# EAGLE design MicrocontrollerCircuit (EAGLE 8.4.1)
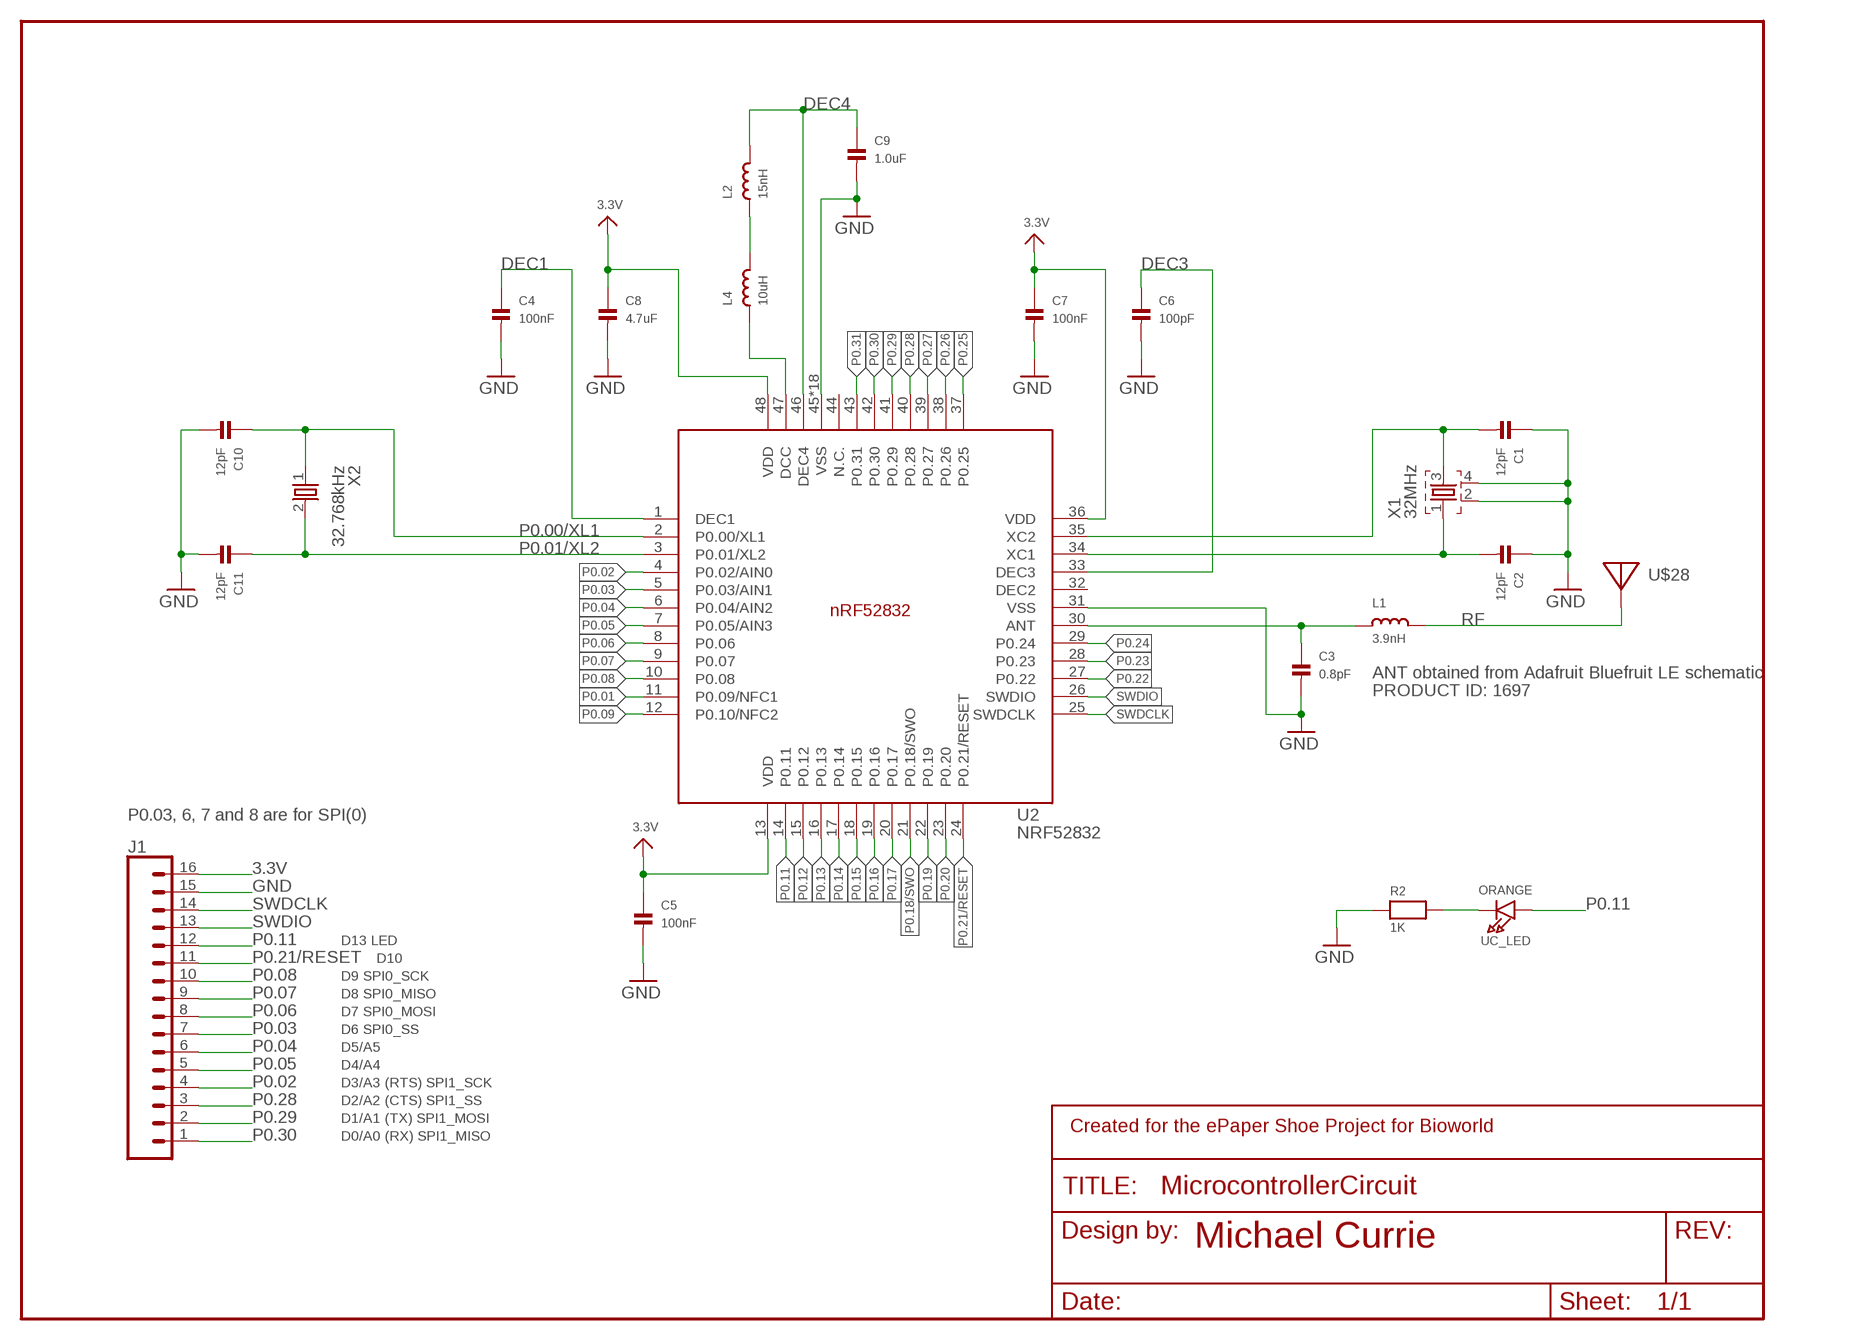
[diagram p0: schematic, sheet 1]

## Parts
C1  12pF  CAP_CERAMIC1206  [1206]
C2  12pF  CAP_CERAMIC1206  [1206]
C3  0.8pF  CAP_CERAMIC1206  [1206]
C4  100nF  CAP_CERAMIC1206  [1206]
C5  100nF  CAP_CERAMIC1206  [1206]
C6  100pF  CAP_CERAMIC1206  [1206]
C7  100nF  CAP_CERAMIC1206  [1206]
C8  4.7uF  CAP_CERAMIC1206  [1206]
C9  1.0uF  CAP_CERAMIC1206  [1206]
C10  12pF  CAP_CERAMIC1206  [1206]
C11  12pF  CAP_CERAMIC1206  [1206]
FRAME2  FRAME-LETTER-MICHAELNO_PACKAGE  [DUMMY]
J1  CONN_16  [1X16]
L1  3.9nH  INDUCTOR0805  [0805]
L2  15nH  INDUCTOR0805  [0805]
L4  10uH  INDUCTOR0805  [0805]
R2  1K  RESISTOR0805  [0805]
U2  NRF52832  [QFN40P600X600X90-48_N]
U$28  ANTENNA_PCBNRF8001_1.6MM  [ANT_PCB_2.4GHZ_NRF8001_1.6MM_1OZ]
UC_LED  ORANGE  LED0805_NOOUTLINE  [CHIPLED_0805_NOOUTLINE]
X1  32MHz  XTAL_32MHZ  [BT-XTAL_2016_N]
X2  32.768kHz  XTAL_32KHZ  [XTAL_3215_N]

## Nets
3.3V: C5.1 C7.1 C8.1 J1.16 U2.13(VDD) U2.36(VDD) U2.48(VDD)
ANT: C3.1 L1.1 U2.30(ANT)
DEC1: C4.1 U2.1(DEC1)
DEC3: C6.1 U2.33(DEC3)
DEC4: C9.1 L2.2 U2.46(DEC4)
GND: C1.1 C2.1 C3.2 C4.2 C5.2 C6.2 C7.2 C8.2 C9.2 C10.2 C11.2 J1.15 R2.1 U2.31(VSS) U2.45(VSS) U2.PAD(VSS) U2.PAD@VIA01(VSS) U2.PAD@VIA02(VSS) U2.PAD@VIA03(VSS) U2.PAD@VIA04(VSS) U2.PAD@VIA05(VSS) U2.PAD@VIA06(VSS) U2.PAD@VIA07(VSS) U2.PAD@VIA08(VSS) U2.PAD@VIA09(VSS) U2.PAD@VIA10(VSS) U2.PAD@VIA11(VSS) U2.PAD@VIA12(VSS) U2.PAD@VIA13(VSS) U2.PAD@VIA14(VSS) U2.PAD@VIA15(VSS) U2.PAD@VIA16(VSS) X1.2 X1.4
N$1: L2.1 L4.2
N$3: C1.2 U2.35(XC2) X1.3
N$5: L4.1 U2.47(DCC)
N$15: R2.2 UC_LED.C
P0.00/XL1: C10.1 U2.2(P0.00/XL1) X2.1
P0.01: U2.11(P0.09/NFC1)
P0.01/XL2: C11.1 U2.3(P0.01/XL2) X2.2
P0.02: J1.4 U2.4(P0.02/AIN0)
P0.03: J1.7 U2.5(P0.03/AIN1)
P0.04: J1.6 U2.6(P0.04/AIN2)
P0.05: J1.5 U2.7(P0.05/AIN3)
P0.06: J1.8 U2.8(P0.06)
P0.07: J1.9 U2.9(P0.07)
P0.08: J1.10 U2.10(P0.08)
P0.09: U2.12(P0.10/NFC2)
P0.11: J1.12 U2.14(P0.11) UC_LED.A
P0.12: U2.15(P0.12)
P0.13: U2.16(P0.13)
P0.14: U2.17(P0.14)
P0.15: U2.18(P0.15)
P0.16: U2.19(P0.16)
P0.17: U2.20(P0.17)
P0.18/SWO: U2.21(P0.18/SWO)
P0.19: U2.22(P0.19)
P0.20: U2.23(P0.20)
P0.21/RESET: J1.11 U2.24(P0.21/RESET)
P0.22: U2.27(P0.22)
P0.23: U2.28(P0.23)
P0.24: U2.29(P0.24)
P0.25: U2.37(P0.25)
P0.26: U2.38(P0.26)
P0.27: U2.39(P0.27)
P0.28: J1.3 U2.40(P0.28)
P0.29: J1.2 U2.41(P0.29)
P0.30: J1.1 U2.42(P0.30)
P0.31: U2.43(P0.31)
RF: L1.2 U$28.FEED
SWDCLK: J1.14 U2.25(SWDCLK)
SWDIO: J1.13 U2.26(SWDIO)
X1: C2.2 U2.34(XC1) X1.1
Unconnected: U2.32(DEC2) U2.44(N.C.)

## Notes on the sheet
- ANT obtained from Adafruit Bluefruit LE schematic
- PRODUCT ID: 1697
- P0.03, 6, 7 and 8 are for SPI(0)
- D13 LED
- D10
- D9 SPI0_SCK
- D8 SPI0_MISO
- D7 SPI0_MOSI
- D6 SPI0_SS
- D5/A5
- D4/A4
- D3/A3 (RTS) SPI1_SCK
- D2/A2 (CTS) SPI1_SS
- D1/A1 (TX) SPI1_MOSI
- D0/A0 (RX) SPI1_MISO

## Library data of the parts
C1-C11 = microbuilder:CAP_CERAMIC: Ceramic Capacitors 0402 - 0402 Surface Mount Capacitors 16pF 50V 5% [Digikey: 445-4899-2-ND] 18pF 50V 5% [Digikey: 490-1281-2-ND] 22pF 50V 5% [Digikey: 490-1283-2-ND] 68pF 50V 5% [Digikey: 490-1289-2-ND] 0.1uF 10V 10% [Digikey: 490-1318-2-ND] 1.0uF 6.3V 10% [Digikey: 490-1320-2-ND] 0603 - 0603 Surface Mount Capacitors 16 pF 50V 5% [Digikey: 445-5051-2-ND] 22 pF 50V [Digikey: PCC220ACVTR-ND] 33 pF 50V 5% [Digikey: 490-1415-1-ND] 56pF 50V 5% [Digikey: 490-1421-1-ND] 220pF 50V 5% [Digikey: 445-1285-1-ND] 680 pF 50V 2200 pF 50V 5% C0G [Digikey: 445-1297-1-ND] 5600 pF 100V 5% X7R [Digikey: 478-3711-1-ND] 0.1 µF 25V 10% [Digikey: PCC2277TR-ND] 0.22 µF 16V 10% X7R [Digikey: 445-1318-1-ND] 1.0 µF 25V 10% [Digikey: 445-5146-2-ND] 0603 - RF Specific 3pF 250V +/-0.1pF RF [Digikey: 712-1347-1-ND] 18 pF 250V 5% [Digikey: 478-3505-1-ND or 712-1322-1-ND] 56 pF 250V 5% C0G RF [Digikey: 490-4867-1-ND] 68 pF 250V RF [Digikey: 490-4868-1-ND] 0805 - 0805 Surface Mount Capacitors 220 pF 250V 2% RF Ceramic Capacitor [Digikey: 712-1398-1-ND] 1000 pF 50V 2% NP0 Ceramic Capacitor [Digikey: 478-3760-1-ND] 0.1 µF 25V 10% Ceramic Capacitor [Digikey: PCC1828TR-ND] 1.0 µF 16V 10% Ceramic Capacitor[Digikey: 490-1691-2-ND] 10.0 µF 10V 10% Ceramic Capacitor[Digikey: 709-1228-1-ND] 10.0 uF 16V 10% Ceramic Capacitor [Digikey: 478-5165-2-ND] 47 uF 6.3V 20% Ceramic Capacitor [Digikey: 587-1779-1-ND or 399-5506-1-ND] 1206 - 1206 Surface Mount Capacitors 47uF 10V 20% Ceramic Capacitor [Digikey: 490-5528-1-ND or 399-5508-1-ND or 445-6010-1-ND] 100uF 6.3V -20%, +80% Y5V Ceramic Capacitor (Digikey: 490-4512-1-ND, Mouser: 81-GRM31CF50J107ZE1L)
FRAME2 = SparkFun-Aesthetics:FRAME-LETTER-MICHAEL: Schematic Frame - Letter Standard 8.5x11 US Letter frame; DESIGNER: Nobody; VERSION: v01
J1 = SparkFun-Connectors:CONN_16: Multi connection point. Often used as Generic Header-pin footprint for 0.1 inch spaced/style header connections On any of the 0.1 inch spaced packages, you can populate with these: Break Away Headers - Straight <https://www.sparkfun.com/products/116> (PRT-00116) Break Away Male Headers - Right Angle <https://www.sparkfun.com/products/553> (PRT-00553) Female Headers <https://www.sparkfun.com/products/115> (PRT-00115) Break Away Headers - Machine Pin <https://www.sparkfun.com/products/117> (PRT-00117) Break Away Female Headers - Swiss Machine Pin <https://www.sparkfun.com/products/743> (PRT-00743) For SCREWTERMINALS and SPRING TERMINALS visit here: Screw Terimnals on SparkFun.com <https://www.sparkfun.com/search/results?term=Screw+Terminals> (5mm/3.5mm/2.54mm spacing) This device is also useful as a general connection point to wire up your design to another part of your project. Our various solder wires solder well into these plated through hole pads. Hook-Up Wire - Assortment (Stranded, 22 AWG) <https://www.sparkfun.com/products/11375> (PRT-11375) Hook-Up Wire - Assortment (Solid Core, 22 AWG) <https://www.sparkfun.com/products/11367> (PRT-11367) View the entire wire category on our website here <https://www.sparkfun.com/categories/141> Special notes: Molex polarized connector foot print use with SKU : PRT-08231 with associated crimp pins and housings. 1MM SMD Version SKU: PRT-10208 NOTES ON THE VARIANTS LOCK and LOCK_LONGPADS... This footprint was designed to help hold the alignment of a through-hole component (i.e. 6-pin header) while soldering it into place. You may notice that each hole has been shifted either up or down by 0.005 of an inch from it's more standard position (which is a perfectly straight line). This slight alteration caused the pins (the squares in the middle) to touch the edges of the holes. Because they are alternating, it causes a "brace" to hold the component in place. 0.005 has proven to be the perfect amount of "off-center" position when using our standard breakaway headers. Although looks a little odd when you look at the bare footprint, once you have a header in there, the alteration is very hard to notice. Also,if you push a header all the way into place, it is covered up entirely on the bottom side.
L1 L2 L4 = microbuilder:INDUCTOR: Inductors 0603: 10nH Ceramic Inductor - microwire antenna/RF (Digikey: 712-1434-2-ND) 0805: 560nH Ceramic Inductor - RF (Digikey: 553-1047-1-ND) 270nH Ceramic Inductor - Q = 40@250MHz, +-5%, 1 Ohm DC Resistance (Digikey: 535-10506-2-ND) 1007 (2518 Metric) SMT: 10µH 10% 250mOhm 820mA 1007 Inductor (Digikey: 587-2189-1-ND) 22µH 10% 500mOhm 580mA 1007 Inductor (Digikey: 587-2190-1-ND) 47µH 10% 950mOhm 420mA 1007 Inductor (Digikey: 587-2191-1-ND) 47µH 5% 100mOhm 1A 1008 Inductor (Digikey: 732-1816-1-ND) 5.0x5.0mm (Taiyo Yuden NR5040 Series) 6.8µH 20% 2.3A 64mOhm Inductor (Digikey: 587-2374-2-ND) 5.0x5.0mm (TDK VLC5045 Series) 4.7µH 20% 3.3A 34mOhm Inductor (Digikey: 445-6526-1-ND) 6.8µH 20% 2.7A 46mOhm Inductor (Digikey: 445-6527-1-ND) 6.0x6.0mm (TDK VLC6045 Series) 4.7µH 20% 3.8A 27mOhm Inductor (Digikey: 445-6538-2-ND) 6.8µH 20% 3A 41mOhm Inductor (Digikey: 445-6540-1-ND) 6.2µH 30% 2.2A 45mOhm Inductor (Digikey: SRR5028-6R2YCT-ND) - Not TDK VLC6045 but footprint should match 6.0x6.0mm (TDK SLF6045 Series) 6.8uH 30% 2A 33mOhm Inductor (Digikey: 445-4572-1-ND, Mouser: 810-SLF645T6R8N2R0PF)
R2 = microbuilder:RESISTOR: Resistors 0402 - 0402 Surface Mount Package 22 Ohm 1% 1/16W [Digikey: 311-22.0LRTR-ND] 33 Ohm 5% 1/16W 1.0K 5% 1/16W 1.5K 5% 1/16W 2.0K 1% 1/16W 10.0K 1% 1/16W [Digikey: 311-10.0KLRTR-ND] 10.0K 5% 1/16W [Digikey: RMCF0402JT10K0TR-ND] 12.1K 1% 1/16W [Digikey: 311-22.0LRTR-ND] 100.0K 5% 1/16W 0603 - 0603 Surface Mount Package 0 Ohm 1/10 Watt 1% Resistor 15 Ohm 1/10 Watt 1% Resistor 33 Ohm 1/10 Watt 1% Resistor 49.9 Ohm 1/10 Watt 1% Resistor 100 Ohm 1/10 Watt 1% Resistor 150 Ohm 1/10 Watt 1% Resistor 240 Ohm 1/10 Watt 1% Resistor 390 Ohm 1/10 Watt 1% Resistor 560 Ohm 1/10 Watt 1% Resistor 680 Ohm 1/10 Watt 1% Resistor 750 Ohm 1/10 Watt 1% Resistor 1.0K Ohm 1/10 Watt 1% Resistor 1.5K Ohm 1/10 Watt 1% Resistor 2.0K Ohm 1/10 Watt 1% Resistor 2.2K Ohm 1/10 Watt 1% Resistor 3.3K Ohm 1/10 Watt 1% Resistor 4.7K Ohm 1/10 Watt 1% Resistor 10.0K Ohm 1/10 Watt 1% Resistor 12.0K Ohm 1/10 Watt 1% Resistor 12.1K Ohm 1/10 Watt 1% Resistor 20.0K Ohm 1/10 Watt 1% Resistor 33.0K Ohm 1/10 Watt 1% Resistor 100.0K Ohm 1/10 Watt 1% Resistor 0805 - 0805 Surface Mount Package 0 Ohm 1/8 Watt 1% Resistor 33 Ohm 1/8 Watt 1% Resistor 100 Ohm 1/8 Watt 1% Resistor 150 Ohm 1/8 Watt 1% Resistor 200 Ohm 1/8 Watt 1% Resistor 240 Ohm 1/8 Watt 1% Resistor 330 Ohm 1/8 Watt 1% Resistor 390 Ohm 1/8 Watt 1% Resistor 470 Ohm 1/8 Watt 1% Resistor 1.0K Ohm 1/8 Watt 1% Resistor 1.5K Ohm 1/8 Watt 1% Resistor 2.0K Ohm 1/8 Watt 1% Resistor 4.7K Ohm 1/8 Watt 1% Resistor 5.1K Ohm 1/8 Watt 1% Resistor 5.6K Ohm 1/8 Watt 1% Resistor 10.0K Ohm 1/8 Watt 1% Resistor 22.0K Ohm 1/8 Watt 1% Resistor 33.0K Ohm 1/8 Watt 1% Resistor 100K Ohm 1/8 Watt 1% Resistor 1206 - 1206 Surface Mount Package 2012 - 2010 Surface Mount Package 0.11 Ohm 1/2 Watt 1% Resistor - Digikey: RHM.11UCT-ND
U2 = Nordic_nRF:NRF52832: nRF52832 Features Single chip, highly flexible, 2.4 GHz multi-protocol SoC 32-bit ARM Cortex-M4F Processor 1.7v to 3.6v operation 512kB flash + 64kB RAM Supports concurrent Bluetooth Smart/ANT protocol operation On-chip NFC tag for Out-of-Band (OOB) pairing Up to +4dBm output power -96dBm sensitivity, Bluetooth Smart Thread safe and run-time protected Event driven API On air compatible with nRF24L and nRF24AP series 2 data rates (2Mbps/1Mbps) PPI - maximum flexibility for power-efficient applications and code simplification Automated power management system with automatic power management of each peripheral Configurable I/O mapping for analog and digital I/O 3 x Master/Slave SPI 2 x Two-wire interface (I²C) UART (RTS/CTS) 3 x PWM AES HW encryption Real Time Counter (RTC) Digital microphone interface (PDM) On-chip balun Applications Internet of Things (IoT) Wearables SmartHome sensors Connected white goods Computer peripherals Voice-command smart remotes A4WP ‘Rezence’ wireless charging Beacons Sports and fitness sensors and hubs Connected health products Smart watches RC Toys Interactive games Building automation and sensor networks
U$28 = microbuilder:ANTENNA_PCB: Various pre-calculated PCB Antennas NRF8001 1.6mm 1Oz - 2.4GHz PCB antenna for 1.6mm PCBs with 1oz copper, double-sided boards (no GND plan beneath antenna). See nRF2740 production files for further information and impedance matching network. 868MHz/2.4GHz DUALBAND - Dual 868MHz and 2.4GHz centered antenna based on board #6 of the CC-ANTENNA-DK from Chipcon/TI
UC_LED = microbuilder:LED: LED 0603 - 0603 Surface Mount Package 2mA: Green LED - Low Power (3.9mcd, 2ma, 1.7Vf) - Digikey: 475-2709-2-ND Orange LED - Low Power (9.8mcd, 2ma, 1.8Vf) - Digikey: 475-1194-2-ND Red LED - Low Power (5mcd, 2ma, 1.8Vf) - Digikey: 475-1195-2-ND Yellow LED - Low Power (7mcd, 2ma, 1.8Vf) - Digikey: 475-1196-2-ND 5mA: Blue LED - Low Power (17mcd, 5ma, 2.9Vf) - Digikey: LNJ937W8CRACT-ND 0805 - 0805 Surface Mount Package 2mA: Red LED (8.8mcd, 2mA, 1.8Vf, Clear) - Low Power [Digikey: 475-2510-1-ND] Green LED (5mcd, 2mA, 1.8Vf, Clear) - Low Power [Digikey: 475-2730-1-ND] Yellow LED (11.3mcd, 2mA, 1.8Vf, Clear) - Low Power [Digikey: 475-2555-1-ND] 20mA: Red LED (104mcd, 20mA, Diffused) - LS R976 [Digikey: 475-1278-6-ND] Red LED (12mcd, 20mA, 2.0Vf, Clear) - APT2012EC [Digikey: 754-1128-1-ND] Green LED (15mcd, 20mA, 2.2Vf, Clear) - APT2012GC [Digikey: 754-1131-1-ND] Orange LED (160mcd, 20mA, 2.1Vf, Clear) - APT2012SECK [Digikey: 754-1130-1-ND] 1206 - 1206 Surface Mount Package Green LED (26mcd, 20mA, Diffused) - LG N971 [Digikey: 475-1407-6-ND] Red LED (15mcd, 20mA, Diffused) - LH N974 [Digikey: 475-1416-6-ND] Cree - Cree High-Power Surface Mount LEDs XPEBWT-L1-0000-00D50 - White 111lm 350mA 2.9Vf 6200K 110�° XTEAWT-00-0000-00000LEE3 - White 114lm 350mA 2.85Vf 5000K 115�° Everlight - Everlight 45-21 Series Surface Mount LEDs 45-21/QK2C-B2832AC2CB2/2T - Warm White 2000mcd 20mA 3.25Vf 3050K 120�° 45-21/LK2C-B38452C4CB2/2T - Nuetral White 2000mcd 20mA 3.25Vf 4150K 120�° 45-21/LK2C-B50634C6CB2/2T - Cold White 2200mcd 20mA 3.25Vf 5650K 120�° PLCC2 Reverse Mount LS T77K-J1L2-1-0-2-R18-Z - Red 11.25mcd 2mA 1.8Vf 630nm 120�° LO T77K-L1M2-24-Z - Orange 19.6mcd 2mA 1.8Vf 606nm 120�° LY T77K-K2M1-26-Z - Yellow 15.7mcd 2mA 1.8Vf 587nm 120�°
X1 = Nordic_nRF:XTAL_32MHZ
X2 = Nordic_nRF:XTAL_32KHZ

## Board
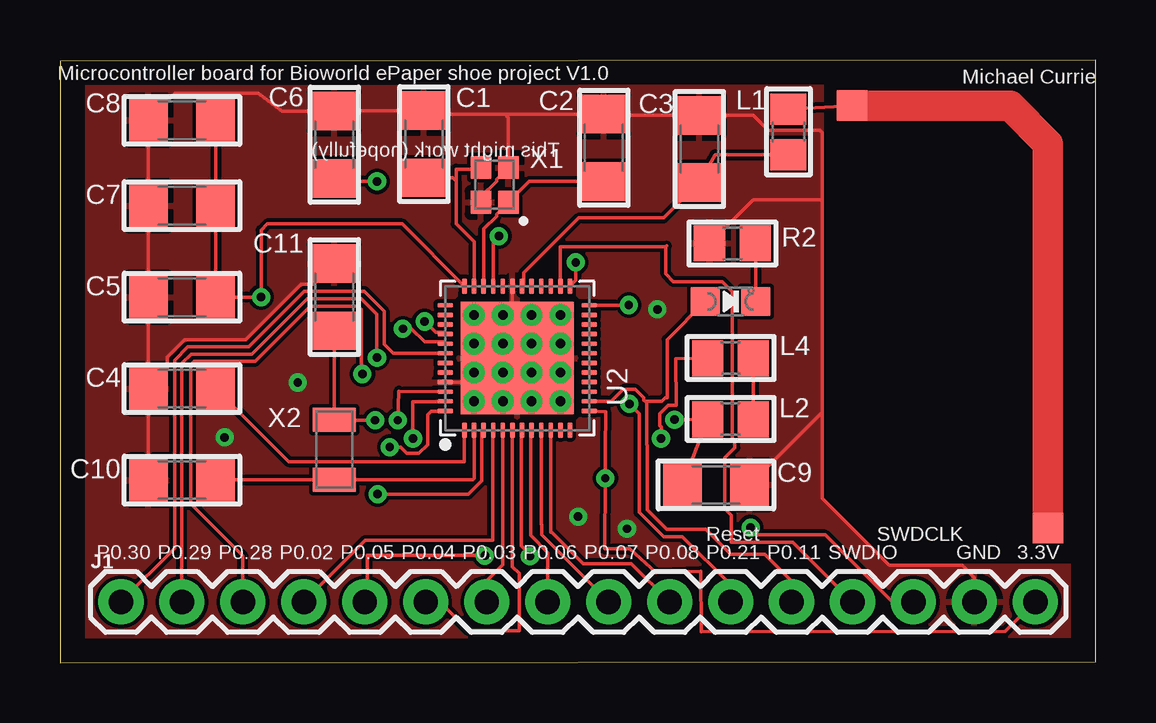
[diagram p1: board, top side]
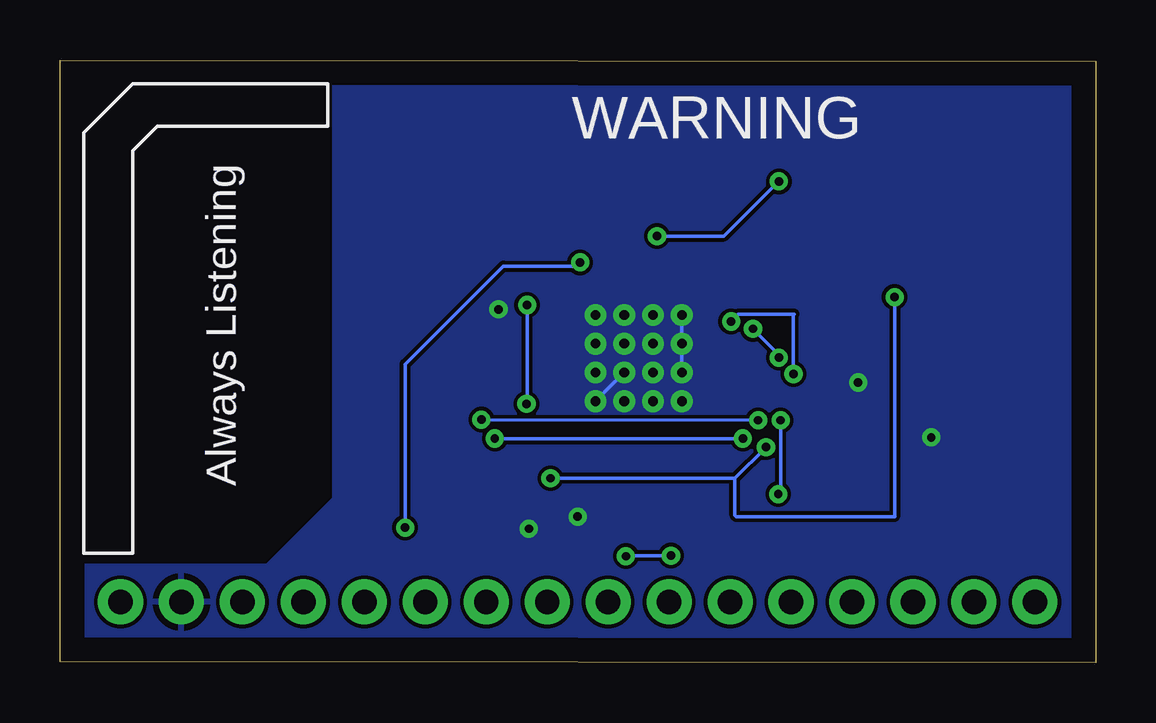
[diagram p2: board, bottom side, seen from below]

Size 43.16 x 25.12 mm. Coordinates in mm from the lower left corner, seen from the top.
Outline: 0,0 43.16,0.05 43.16,25.12 0,25.07 0,0
Copper layers (1*16): Top 0.035mm / dielectric 1.5mm / Bottom 0.035mm
Design rules "default": minimum track width 6mil, minimum drill 0.35mm, track to track 6mil, track to pad 6mil, pad to pad 6mil, via to via 6mil, smd to smd 6mil, copper to edge 40mil, drill to drill 6mil, minimum pad ring 10mil, minimum via ring 8mil, stop-mask expansion 4mil, vias tented up to drill 0mil, thermal gap 10mil

### Footprints (pad centres in the part's own frame; a part is rotated, then mirrored left to right if it is on the bottom)
1206 = smd 1.6 x 1.8: 1 -1.4,0; 2 1.4,0
1X16 = drill 1.016 pad 1.88: 1 0,0; 2 2.54,0; 3 5.08,0; 4 7.62,0; 5 10.16,0; 6 12.7,0; 7 15.24,0; 8 17.78,0; 9 20.32,0; 10 22.86,0; 11 25.4,0; 12 27.94,0; 13 30.48,0; 14 33.02,0; 15 35.56,0; 16 38.1,0
0805 = smd 1.3 x 1.5: 1 -0.95,0; 2 0.95,0
QFN40P600X600X90-48_N = smd 0.65 x 0.2: 1 -3,2.2; 2 -3,1.8; 3 -3,1.4; 4 -3,1; 5 -3,0.6; 6 -3,0.2; 7 -3,-0.2; 8 -3,-0.6; 9 -3,-1; 10 -3,-1.4; 11 -3,-1.8; 12 -3,-2.2; 25 3,-2.2; 26 3,-1.8; 27 3,-1.4; 28 3,-1; 29 3,-0.6; 30 3,-0.2; 31 3,0.2; 32 3,0.6; 33 3,1; 34 3,1.4; 35 3,1.8; 36 3,2.2 | smd 0.2 x 0.65: 13 -2.2,-3; 14 -1.8,-3; 15 -1.4,-3; 16 -1,-3; 17 -0.6,-3; 18 -0.2,-3; 19 0.2,-3; 20 0.6,-3; 21 1,-3; 22 1.4,-3; 23 1.8,-3; 24 2.2,-3; 37 2.2,3; 38 1.8,3; 39 1.4,3; 40 1,3; 41 0.6,3; 42 0.2,3; 43 -0.2,3; 44 -0.6,3; 45 -1,3; 46 -1.4,3; 47 -1.8,3; 48 -2.2,3 | smd 4.7 x 4.7: PAD 0,0 | drill 0.4: PAD@VIA01 -1.8,1.8; PAD@VIA02 -1.8,0.6; PAD@VIA03 -1.8,-0.6; PAD@VIA04 -1.8,-1.8; PAD@VIA05 -0.6,1.8; PAD@VIA06 -0.6,0.6; PAD@VIA07 -0.6,-0.6; PAD@VIA08 -0.6,-1.8; PAD@VIA09 0.6,1.8; PAD@VIA10 0.6,0.6; PAD@VIA11 0.6,-0.6; PAD@VIA12 0.6,-1.8; PAD@VIA13 1.8,1.8; PAD@VIA14 1.8,0.6; PAD@VIA15 1.8,-0.6; PAD@VIA16 1.8,-1.8
ANT_PCB_2.4GHZ_NRF8001_1.6MM_1OZ = smd 1.27 x 1.27: FEED 0,0; TESTPOINT -8.169,17.605
CHIPLED_0805_NOOUTLINE = smd 1.2 x 1.2: A 0,-1.05; C 0,1.05
BT-XTAL_2016_N = smd 0.95 x 0.85: 1 -0.725,-0.575; 2 0.725,-0.575; 3 0.725,0.575; 4 -0.725,0.575
XTAL_3215_N = smd 1 x 1.8: 1 -1.25,0; 2 1.25,0

### Placement (x,y rotation side)
C1  15.16,21.62 270 top
C2  22.66,21.46 270 top
C3  26.64,21.41 90 top
C4  5.08,11.43 180 top
C5  5.08,15.24 180 top
C6  11.43,21.59 90 top
C7  5.08,19.05 180 top
C8  5.08,22.61 180 top
C9  27.33,7.42 0 top
C10  5.08,7.62 180 top
C11  11.43,15.24 90 top
FRAME2  2.54,45.72 270 top  (outside the outline)
J1  2.54,2.54 0 top
L1  30.35,22.12 90 top
L2  27.94,10.16 180 top
L4  27.94,12.7 0 top
R2  28.02,17.48 0 top
U2  19.05,12.7 90 top
U$28  32.99,23.22 180 top
UC_LED  27.94,15.06 270 top
X1  18.11,19.91 90 top
X2  11.43,8.89 90 top

### Tracks (layer width: path | path; a pad name or v marks a point on that pad's centre or on a via)
3.3V  (via drill 0.35)
  Top 0.152: C8.1 C7.1 C5.1 v8.38,15.24 8.38,18.03 8.64,18.29 14.26,18.29 U2.36 | J1.16 39.4,1.32 26.72,1.29 26.7,3.81 24.84,3.76 | 24.84,3.76 24.77,3.76 | U2.13 22.73,10.46 22.73,8.89 v22.72,7.69 22.71,4.75 23.75,4.75 24.84,3.76 | U2.48 15.47,10.49 15.31,10.33 15.31,9.1 14.96,8.74 14.45,8.74 14.21,8.99 v13.74,8.99
  Bottom 0.152: 15.04,7.69 v13.74,8.99 | 15.04,7.69 v22.72,7.69 | v8.38,15.24 8.38,6.1 14.99,6.1 15.04,6.15 15.04,7.69
ANT
  Top 0.152: U2.30 19.32,15.77 19.32,16.25 21.62,18.54 25.15,18.54 26.14,19.53 C3.1 27.3,21.17 L1.1
DEC1
  Top 0.152: C4.1 9.53,8.38 16.84,8.38 U2.1
DEC3  (via drill 0.35)
  Top 0.152: U2.33 18.05,17.54 v18.29,17.78 | v13.21,20.07 11.55,20.07 C6.1
  Bottom 0.152: v18.29,17.78 15.49,17.78 v13.21,20.07
DEC4  (via drill 0.35)
  Top 0.152: C9.1 L2.2 v25.6,10.13 | v14.07,10.11 14.12,11.33 U2.46
  Bottom 0.152: v25.6,10.13 v14.07,10.11
GND  (via drill 0.35)
  Top 0.152: U2.PAD@VIA03 19.59,10.96 19.59,12.16 U2.PAD | U2.PAD@VIA15 19.59,14.44 19.59,13.24 U2.PAD | U2.PAD U2.PAD@VIA16 | U2.PAD U2.PAD@VIA11 U2.PAD@VIA12 | U2.PAD 20.25,12.7 U2.PAD@VIA08 | U2.PAD U2.PAD@VIA07 | U2.PAD U2.PAD@VIA04 | U2.PAD 19.05,11.5 U2.PAD@VIA02 | U2.PAD U2.PAD@VIA06 17.27,12.1 | 17.27,12.1 U2.PAD@VIA05 | U2.PAD U2.PAD@VIA01 | U2.PAD@VIA10 U2.PAD@VIA09 | U2.PAD@VIA13 U2.PAD | U2.PAD U2.PAD@VIA10 | U2.PAD@VIA10 U2.PAD@VIA14 18.85,14.9 U2.31 | 18.54,22.86 C2.1 22.71,22.81 C3.2 28.89,22.81 29.51,22.2 31.65,22.2 31.75,22.1 31.75,19.3 | 18.54,22.86 15.32,22.86 C1.1 11.45,23.02 C6.2 9.27,22.99 8.27,23.73 4.81,23.73 C8.2 C7.2 C5.2 C4.2 | C4.2 C10.2 | C4.2 4.47,12.22 4.47,12.74 5.21,13.47 7.75,13.47 10.06,15.78 10.57,15.78 C11.2 | 31.75,10.44 C9.2 | 31.75,19.3 31.75,10.44 | R2.1 28.9,19.3 31.75,19.3 | X1.4 17.54,19.41 18.19,20.07 18.19,20.14 X1.2 18.69,22.72 18.54,22.86 | J1.15 38.1,3.56 37.59,4.06 34.54,4.06 31.75,6.86 31.75,10.44 | U2.45 16.87,11.7 17.27,12.1
  Bottom 0.152: U2.PAD@VIA13 U2.PAD@VIA09 U2.PAD@VIA05 | U2.PAD@VIA04 U2.PAD@VIA07
  other vias: 24.89,14.73 21.59,6.1 23.62,5.59 9.91,11.68 6.86,9.4
  pour Top: 0,25.15 31.75,25.15 31.75,6.86 34.54,4.06 43.18,4.06 43.18,0 0,0
  pour Bottom: -0.25,25.4 31.75,25.4 31.75,6.86 34.54,4.06 43.18,4.06 43.18,0 0,0 0,25.15
N$1
  Top 0.152: L4.2 L2.1
N$3
  Top 0.152: U2.35 17.25,17.55 16.51,18.29 16.51,20.07 | 16.51,20.07 16.51,20.57 17.47,20.57 X1.3 | C1.2 16.36,20.21 16.51,20.07
N$5  (via drill 0.35)
  Top 0.152: L4.1 25.65,12.67 25.68,10.74 25.35,10.74 25,10.39 25,9.88 25.05,9.83 25.04,9.83 v25.04,9.35 | U2.47 16.02,10.87 14.71,10.87 v14.71,9.35
  Bottom 0.152: v25.04,9.35 v14.71,9.35
N$15
  Top 0.152: R2.2 28.99,17.45 UC_LED.C
P0.00/XL1
  Top 0.152: 11.48,7.64 X2.1 | 11.48,7.64 17.19,7.64 17.25,7.7 U2.2 | C10.1 6.5,7.64 11.48,7.64
P0.01/XL2  (via drill 0.35)
  Top 0.152: U2.3 17.58,9.63 17.58,7.6 17.02,7.03 v13.23,7.03 | v13.13,10.11 11.46,10.11 X2.2 C11.1
  Bottom 0.152: v13.23,7.03 13.13,7.13 v13.13,10.11
P0.02
  Top 0.152: J1.4 12.73,5.11 18.03,5.11 18.03,9.68 U2.4
P0.03
  Top 0.152: J1.7 17.78,3.43 18.44,4.09 U2.5
P0.04
  Top 0.152: J1.6 15.82,2.54 17.02,1.35 19.13,1.35 19.13,3.73 18.85,4.01 U2.6
P0.05  (via drill 0.35)
  Top 0.152: J1.5 12.8,2.64 12.8,4.5 17.68,4.5 v17.7,4.47 | v19.58,4.45 19.58,4.52 19.23,4.88 19.23,9.68 U2.7
  Bottom 0.152: v17.7,4.47 19.56,4.47 v19.58,4.45
P0.06
  Top 0.152: J1.8 20.32,4.6 19.61,5.31 19.61,9.66 U2.8
P0.07
  Top 0.152: J1.9 20.07,5.33 20.07,5.77 20.05,5.78 U2.9
P0.08
  Top 0.152: J1.10 23.8,4.14 21.79,4.14 20.5,5.44 20.45,5.44 U2.10
P0.11
  Top 0.152: UC_LED.A 25.3,13.47 25.3,11.05 25.23,11.05 25.08,10.9 24.38,10.9 | J1.12 30.48,3.4 29.36,4.52 27.94,4.52 26.9,5.56 25.27,5.56 24.46,6.38 24.46,9.07 24.44,9.1 24.44,10.85 24.38,10.9 | 24.38,10.9 24.33,10.95 24.33,11.05 23.98,11.4 23.47,11.4 22.97,10.9 U2.14
P0.21/RESET  (via drill 0.35)
  Top 0.152: J1.11 27.94,3.25 25.93,5.26 25.15,5.26 24.13,6.27 24.13,10.39 v23.72,10.79 | v23.7,14.91 23.69,14.9 U2.24
  Bottom 0.152: v23.72,10.79 23.7,10.82 v23.7,14.91
P0.28  (via drill 0.35)
  Top 0.152: J1.3 7.62,4.46 5.45,6.62 5.45,12.42 5.59,12.56 8.12,12.56 10.44,14.87 12.43,14.87 12.56,14.73 12.56,12.08 v12.6,12.04 | U2.40 15.98,13.77 15.65,13.77 v15.2,14.22 v15.19,14.22
  Bottom 0.152: v12.6,12.04 12.6,14.5 12.57,14.53 14.89,14.53 v15.19,14.22
P0.29  (via drill 0.35)
  Top 0.152: v13.2,12.72 13.2,14.52 12.55,15.17 10.31,15.17 8,12.86 5.46,12.86 5.08,12.48 J1.2 | v14.29,13.92 14.64,13.92 15.19,13.37 15.98,13.37 U2.41
  Bottom 0.152: v13.2,12.72 13.2,12.84 v14.29,13.92
P0.30
  Top 0.152: J1.1 4.78,4.78 4.78,12.61 5.33,13.17 7.87,13.17 10.18,15.48 12.68,15.48 13.51,14.64 13.51,13.27 13.88,12.9 U2.42
RF
  Top 0.152: U$28.FEED L1.2
SWDCLK  (via drill 0.35)
  Top 0.152: v28.78,5.64 29.08,5.33 31.88,5.33 34.67,2.54 J1.14 | v21.49,16.69 21.49,15.94 U2.25
  Bottom 0.152: v28.78,5.64 28.78,12.45 24.69,16.54 21.64,16.54 v21.49,16.69
SWDIO
  Top 0.152: J1.13 30.53,5.03 27.97,5.03 27.97,6.16 27.7,6.42 27.7,8.55 28.12,8.97 28.12,9.21 28.01,9.31 28.01,15.46 27.59,15.89 25.56,15.89 25.25,16.21 25.25,17.35 | 25.25,17.35 25.27,17.37 | 25.25,17.35 20.85,17.35 U2.26
X1
  Top 0.152: U2.34 17.65,18.08 18.19,18.62 18.19,18.69 X1.1 19.56,20.06 C2.2

### Text on the board
tPlace: Microcontroller board for Bioworld ePaper shoe project V1.0 | Michael Currie | This might work (hopefully) | Reset | SWDCLK | P0.30 | P0.29 | P0.28 | P0.02 | P0.05 | P0.04 | P0.03 | P0.06 | P0.07 | P0.08 | P0.21 | P0.11 | SWDIO | GND | 3.3V
bPlace: WARNING | Always Listening